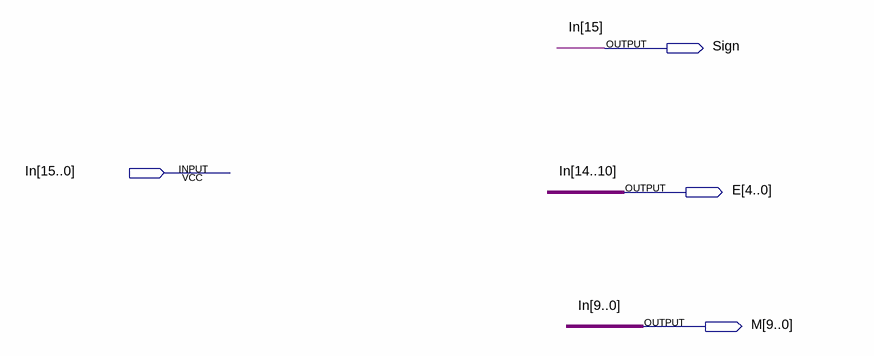
[diagram p0: schematic sheet]
// Quartus schematic data_FP16.bdf as structural Verilog: 0 symbols, 4 pins
module data_FP16 (
  input  [15:0] In,
  output Sign,
  output [4:0] E,
  output [9:0] M
);


  assign E = In[14:10];
  assign M = In[9:0];
  assign Sign = In[15];
endmodule
